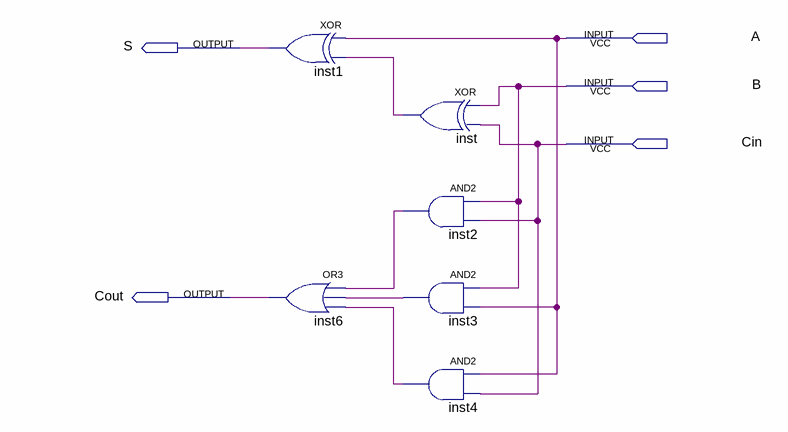
[diagram p0: schematic sheet]
// Quartus schematic somador.bdf as structural Verilog: 6 symbols, 5 pins
module somador (
  input  A,
  input  B,
  input  Cin,
  output S,
  output Cout
);

  wire inst2_out, inst3_out, inst4_out, inst_out;

  xor inst1 (S, A, inst_out);
  or inst6 (Cout, inst2_out, inst3_out, inst4_out);
  xor inst (inst_out, B, Cin);
  and inst2 (inst2_out, B, Cin);
  and inst3 (inst3_out, B, A);
  and inst4 (inst4_out, A, Cin);
endmodule
